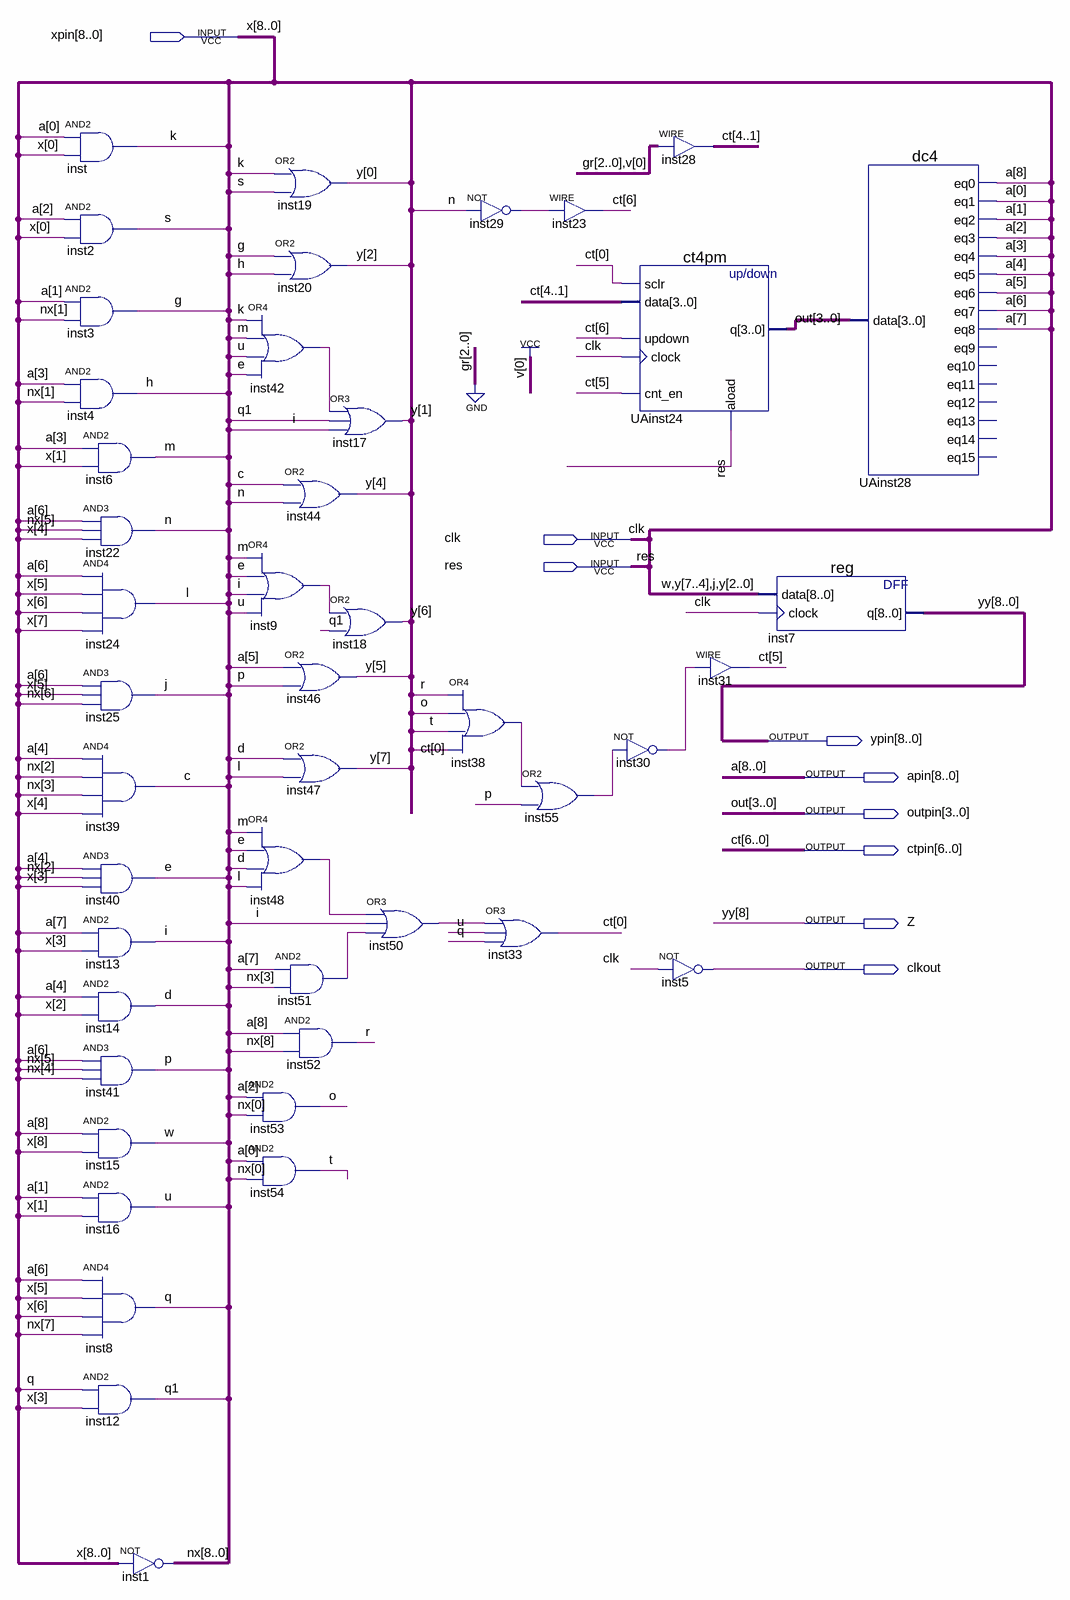
[diagram p0: schematic sheet]
// Quartus schematic UA.bdf as structural Verilog: 45 symbols, 9 pins
module UA (
  input  [8:0] xpin,
  input  clk,
  input  res,
  output [8:0] ypin,
  output [8:0] apin,
  output [3:0] outpin,
  output [6:0] ctpin,
  output Z,
  output clkout
);

  wire c, d, e, g, h, i, inst9_out, inst29_out, inst30_out, inst38_out, inst42_out, inst48_out, inst50_out,
       inst51_out, inst55_out, j, k, l, m, n, o, p, q, q1, r, s, t, u, w;
  wire [7:0] y;
  wire [8:0] nx;

  and inst (k, apin[0], xpin[0]);
  and inst2 (s, apin[2], xpin[0]);
  and inst3 (g, apin[1], nx[1]);
  and inst4 (h, apin[3], nx[1]);
  and inst6 (m, apin[3], xpin[1]);
  and inst22 (n, apin[6], nx[5], xpin[4]);
  and inst24 (l, apin[6], xpin[5], xpin[6], xpin[7]);
  and inst25 (j, apin[6], xpin[5], nx[6]);
  and inst39 (c, apin[4], nx[2], nx[3], xpin[4]);
  and inst40 (e, apin[4], nx[2], xpin[3]);
  and inst13 (i, apin[7], xpin[3]);
  and inst14 (d, apin[4], xpin[2]);
  and inst41 (p, apin[6], nx[5], nx[4]);
  and inst15 (w, apin[8], xpin[8]);
  and inst16 (u, apin[1], xpin[1]);
  and inst8 (q, apin[6], xpin[5], xpin[6], nx[7]);
  and inst12 (q1, q, xpin[3]);
  assign nx = ~xpin;  // NOT inst1, 9 bits wide
  or inst42 (inst42_out, k, m, u, e);
  or inst9 (inst9_out, m, e, i, u);
  or inst48 (inst48_out, m, e, d, l);
  and inst53 (o, apin[2], nx[0]);
  and inst54 (t, apin[0], nx[0]);
  or inst19 (y[0], k, s);
  or inst20 (y[2], g, h);
  or inst17 (y[1], inst42_out, q1, i);
  or inst44 (y[4], c, n);
  or inst18 (y[6], inst9_out, q1);
  or inst46 (y[5], apin[5], p);
  or inst47 (y[7], d, l);
  and inst51 (inst51_out, apin[7], nx[3]);
  and inst52 (r, apin[8], nx[8]);
  or inst50 (inst50_out, inst48_out, i, inst51_out);
  not inst29 (inst29_out, n);
  or inst38 (inst38_out, r, o, t, ctpin[0]);
  assign ctpin[6] = inst29_out;  // WIRE inst23
  or inst55 (inst55_out, inst38_out, p);
  or inst33 (ctpin[0], inst50_out, u, q);
  ct4pm UAinst24 (
    .sclr(ctpin[0]), .data(ctpin[4:1]), .updown(ctpin[6]), .clock(clk), .cnt_en(ctpin[5]), .aload(res),
    .q(outpin));
  not inst30 (inst30_out, inst55_out);
  assign ctpin[4:1] = 4'b0001;  // WIRE inst28
  assign ctpin[5] = inst30_out;  // WIRE inst31
  not inst5 (clkout, clk);
  \reg  inst7 (.data({w, y[7:4], j, y[2:0]}), .clock(clk), .q(ypin));
  dc4 UAinst28 (
    .data(outpin), .eq0(apin[8]), .eq1(apin[0]), .eq2(apin[1]), .eq3(apin[2]), .eq4(apin[3]), .eq5(apin[4]),
    .eq6(apin[5]), .eq7(apin[6]), .eq8(apin[7]));  // open: eq9, eq10, eq11, eq12, eq13, eq14, eq15

  assign Z = ypin[8];

  // Other names for the same wires on the sheet: a[8:0] = apin; ct[6:0] = ctpin; out[3:0] = outpin; x[8:0] = xpin;
  //   yy[8:0] = ypin
endmodule
